# Altium project PA_CONTROL_BOARD.PrjPcb
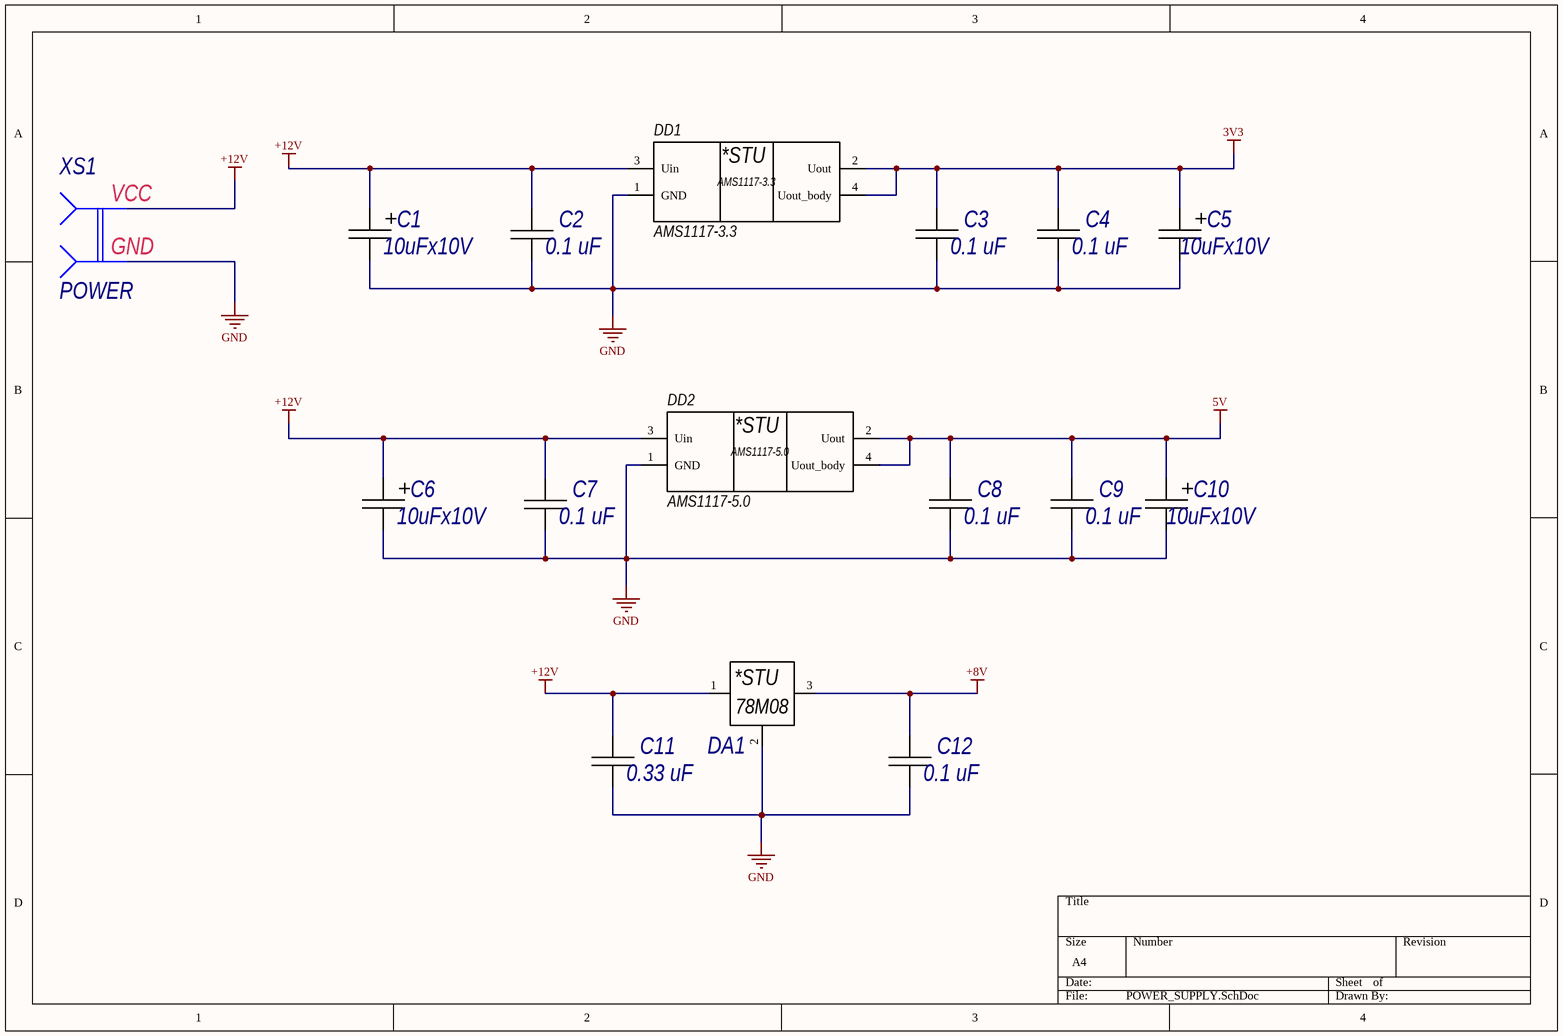
[diagram p0: POWER_SUPPLY.SchDoc]
12 sheets, 125 parts. Net scope: flat (ports and power ports of the same name join across sheets).
Board file: PA_CONTROL_BOARD.PcbDoc
Sheets:
  POWER_SUPPLY.SchDoc
  CAN.SchDoc
  FLASH.SchDoc
  DS18B20.SchDoc
  DIRECTIONAL_COUPLER.SchDoc
  FAN_CTRL.SchDoc
  JTAG_MCU.SchDoc
  MCU_CORE.SchDoc
  IIC_LCD.SchDoc
  EEPROM.SchDoc
  USB.SchDoc
  RS485.SchDoc

## Sheet POWER_SUPPLY.SchDoc
size A4; SheetNumber: 1; SheetTotal: 3

### Parts
C1  10uFx10V
C2  0.1 uF  [C0805C]
C3  0.1 uF  [C0805C]
C4  0.1 uF  [C0805C]
C5  10uFx10V  [TECAP_D]
C6  10uFx10V
C7  0.1 uF  [C0805C]
C8  0.1 uF  [C0805C]
C9  0.1 uF  [C0805C]
C10  10uFx10V  [TECAP_D]
C11  0.33 uF  [C0805C]
C12  0.1 uF  [C0805C]
DA1  78M08CDT  [SC_TO-252AA]  (value not drawn)
DD1  AMS1117-3.3  [SOT229P700X180-4N]
DD2  AMS1117-5.0  [SOT229P700X180-4N]
XS1  POWER  [DG25C-B-02P-13]

### Nets
3V3: C3.2 C4.2 C5.1 DD1.2(Uout) DD1.4(Uout_body)
5V: C8.2 C9.2 C10.1 DD2.2(Uout) DD2.4(Uout_body)
+8V: C12.2 DA1.3(Out)
+12V: C1.1 C2.2 C6.1 C7.2 C11.2 DA1.1(In) DD1.3(Uin) DD2.3(Uin) XS1.2
GND: C1.2 C2.1 C3.1 C4.1 C5.2 C6.2 C7.1 C8.1 C9.1 C10.2 C11.1 C12.1 DA1.2(GND) DD1.1(GND) DD2.1(GND) XS1.1

### Notes on the sheet
- (in symbol 78M08CDT) *STU; 78M08
- (in symbol AMS1117-3.3) *STU
- (in symbol AMS1117-5.0) *STU
- (in symbol CONNECT_PW) VCC; GND

### Library data of the parts
C1 C5 C6 C10 = CAP_TECAP_A: Type: Конденсатор; Published: 20.08.2010; Publisher: Andrew Danich
C2-C4 C7-C9 C11 C12 = CAP_0805: Type: Конденсатор; Published: 18.05.2010; Publisher: Andrew Danich
DD1 = AMS1117-3.3: Sot223/Pkg 1-Amp 3.3-Volt Low Drop Out Voltage Regulatator; MF: Advanced Monolithic Systems; Price: None; Package: None; Value: *; MP: AMS1117-3.3; Availability: Unavailable; SnapEDA_Link: https://www.snapeda.com/parts/AMS1117-3.3/Advanced%20Monolithic%20Systems/view-part/53450/?ref=snap
DD2 = AMS1117-5.0: Sot223/Pkg 1-Amp 3.3-Volt Low Drop Out Voltage Regulatator; MP: AMS1117-3.3; MF: Advanced Monolithic Systems; Price: None; Package: None; Value: *; Availability: Unavailable; SnapEDA_Link: https://www.snapeda.com/parts/AMS1117-3.3/Advanced%20Monolithic%20Systems/view-part/53450/?ref=snap
XS1 = CONNECT_PW: Value: Connector; Published: 07.03.2013; Publisher: Andrew Danich; Type: Розетка
DA1 = 78M08CDT: Published: 13.08.2015; Publisher: Andrew Danich; Type: Микросхема

## Sheet CAN.SchDoc
size A4
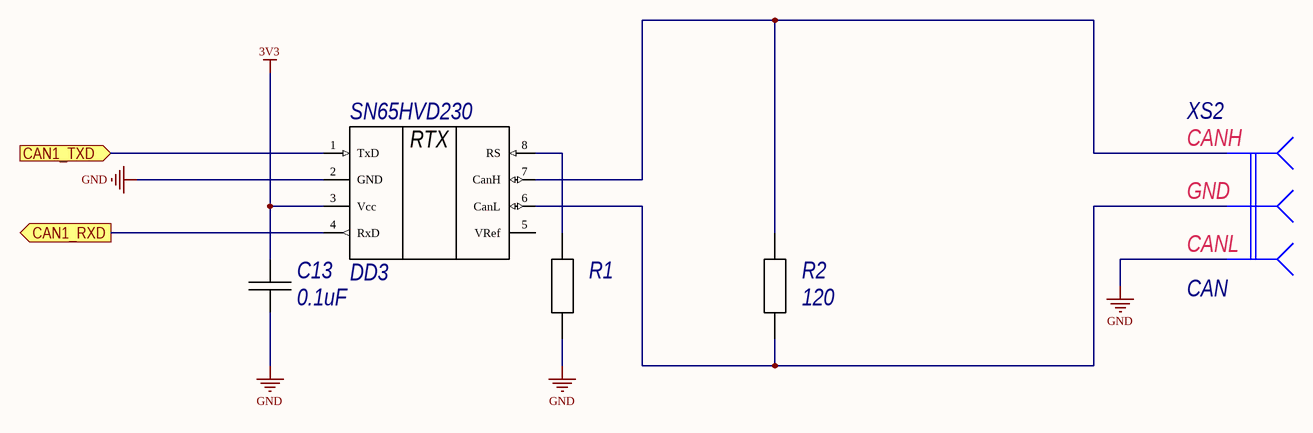
[diagram p1: CAN.SchDoc]

### Parts
C13  0.1uF  [C0805C]
DD3  SN65HVD230  [SOIC8 (SO-8)]
R1  R0805  [C0805R]  (value not drawn)
R2  120  [C0805R]
XS2  CAN  [YX-XH-3]

### Ports
CAN1_RXD (out), CAN1_TXD (in)

### Nets
3V3: C13.2 DD3.3(Vcc)
GND: C13.1 DD3.2(GND) R1.2 XS2.3
CAN1_RXD: DD3.4(RxD) ; port CAN1_RXD
CAN1_TXD: DD3.1(TxD) ; port CAN1_TXD
NetDD3_6: DD3.6(CanL) R2.2 XS2.2
NetDD3_7: DD3.7(CanH) R2.1 XS2.1
NetDD3_8: DD3.8(RS) R1.1

Not connected (* = marked no-connect by the designer): DD3 5(VRef)

### Notes on the sheet
- (in symbol CONNECT_CAN) CANH; GND; CANL
- (in symbol SN65HVD230) RTX

### Library data of the parts
C13 = CAP_0805: Type: Конденсатор; Published: 18.05.2010; Publisher: Andrew Danich
DD3 = SN65HVD230: Высокоскоростной CAN-Трансивер, 1Мб/с, 12В/24В, до 112 узлов; Published: 26.02.2013; Publisher: Andrew Danich; Type: Микросхема
R2 = R0805: Published: 24.03.2010; Publisher: Andrew Danich; Type: Резистор
XS2 = CONNECT_CAN: Published: 07.03.2013; Publisher: Andrew Danich; Type: Розетка
R1 = R0805: Published: 24.03.2010; Publisher: Andrew Danich; Type: Резистор

## Sheet FLASH.SchDoc
size A4
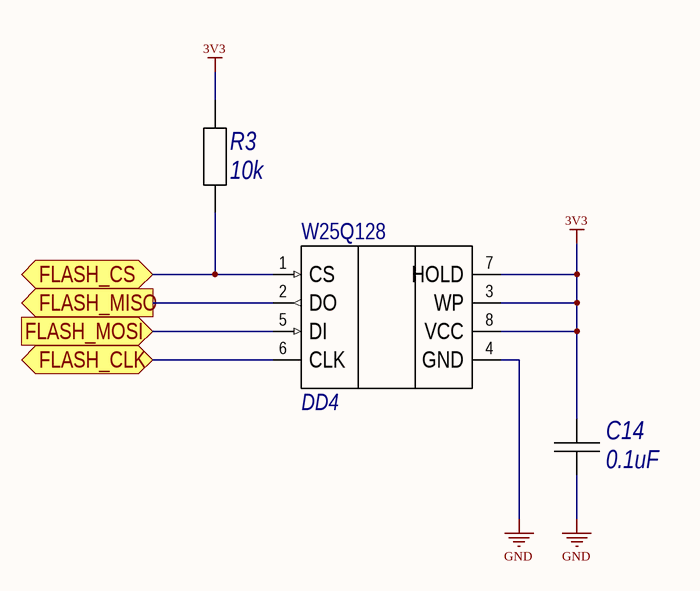
[diagram p2: FLASH.SchDoc]

### Parts
C14  0.1uF  [C0805C]
DD4  W25Q128  [SOIC8 (SO-8)]
R3  10k  [C0805R]

### Ports
FLASH_CLK (bidir), FLASH_CS (bidir), FLASH_MISO (out), FLASH_MOSI (in)

### Nets
3V3: C14.2 DD4.3(WP) DD4.7(HOLD) DD4.8(VCC) R3.2
GND: C14.1 DD4.4(GND)
FLASH_CLK: DD4.6(CLK) ; port FLASH_CLK
FLASH_CS: DD4.1(CS) R3.1 ; port FLASH_CS
FLASH_MISO: DD4.2(DO) ; port FLASH_MISO
FLASH_MOSI: DD4.5(DI) ; port FLASH_MOSI

### Library data of the parts
C14 = CAP_0805: Type: Конденсатор; Published: 18.05.2010; Publisher: Andrew Danich
R3 = RES_0805: Published: 24.03.2010; Publisher: Andrew Danich; Type: Резистор
DD4 = W25Q128: Value: *

## Sheet DS18B20.SchDoc
size A4
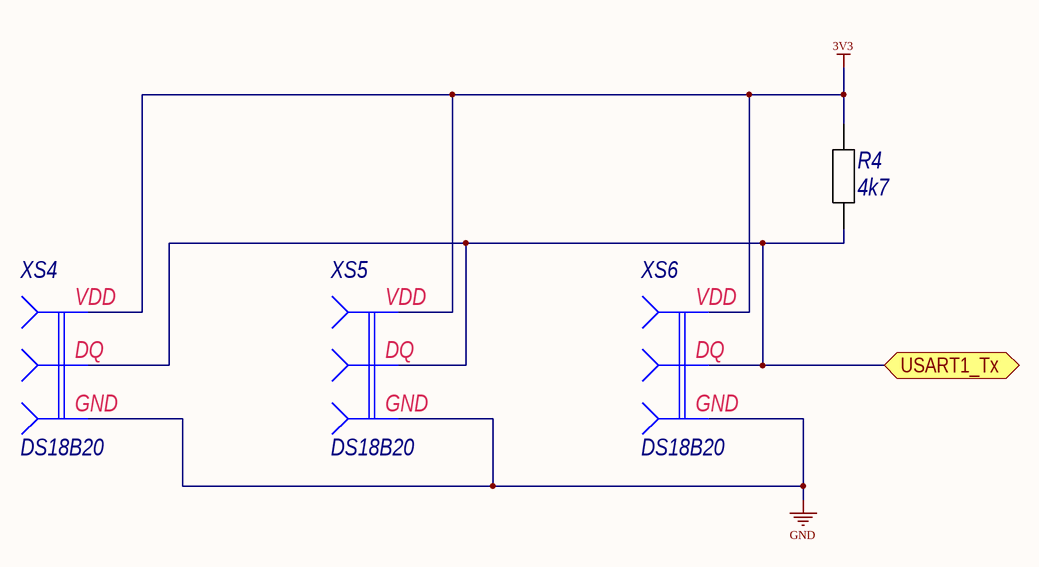
[diagram p3: DS18B20.SchDoc]

### Parts
R4  4k7  [C0805R]
XS4  DS18B20  [YX-XH-3]
XS5  DS18B20  [YX-XH-3]
XS6  DS18B20  [YX-XH-3]

### Ports
USART1_Tx (bidir)

### Nets
3V3: R4.1 XS4.1 XS5.1 XS6.1
GND: XS4.3 XS5.3 XS6.3
DS18B20: R4.2 XS4.2 XS5.2 XS6.2 ; port USART1_Tx

### Notes on the sheet
- (in symbol DS18B20) VDD; DQ; GND

### Library data of the parts
R4 = R0805: Published: 24.03.2010; Publisher: Andrew Danich; Type: Резистор
XS4-XS6 = DS18B20: Published: 07.03.2013; Publisher: Andrew Danich; Type: Розетка

## Sheet DIRECTIONAL_COUPLER.SchDoc
size A4
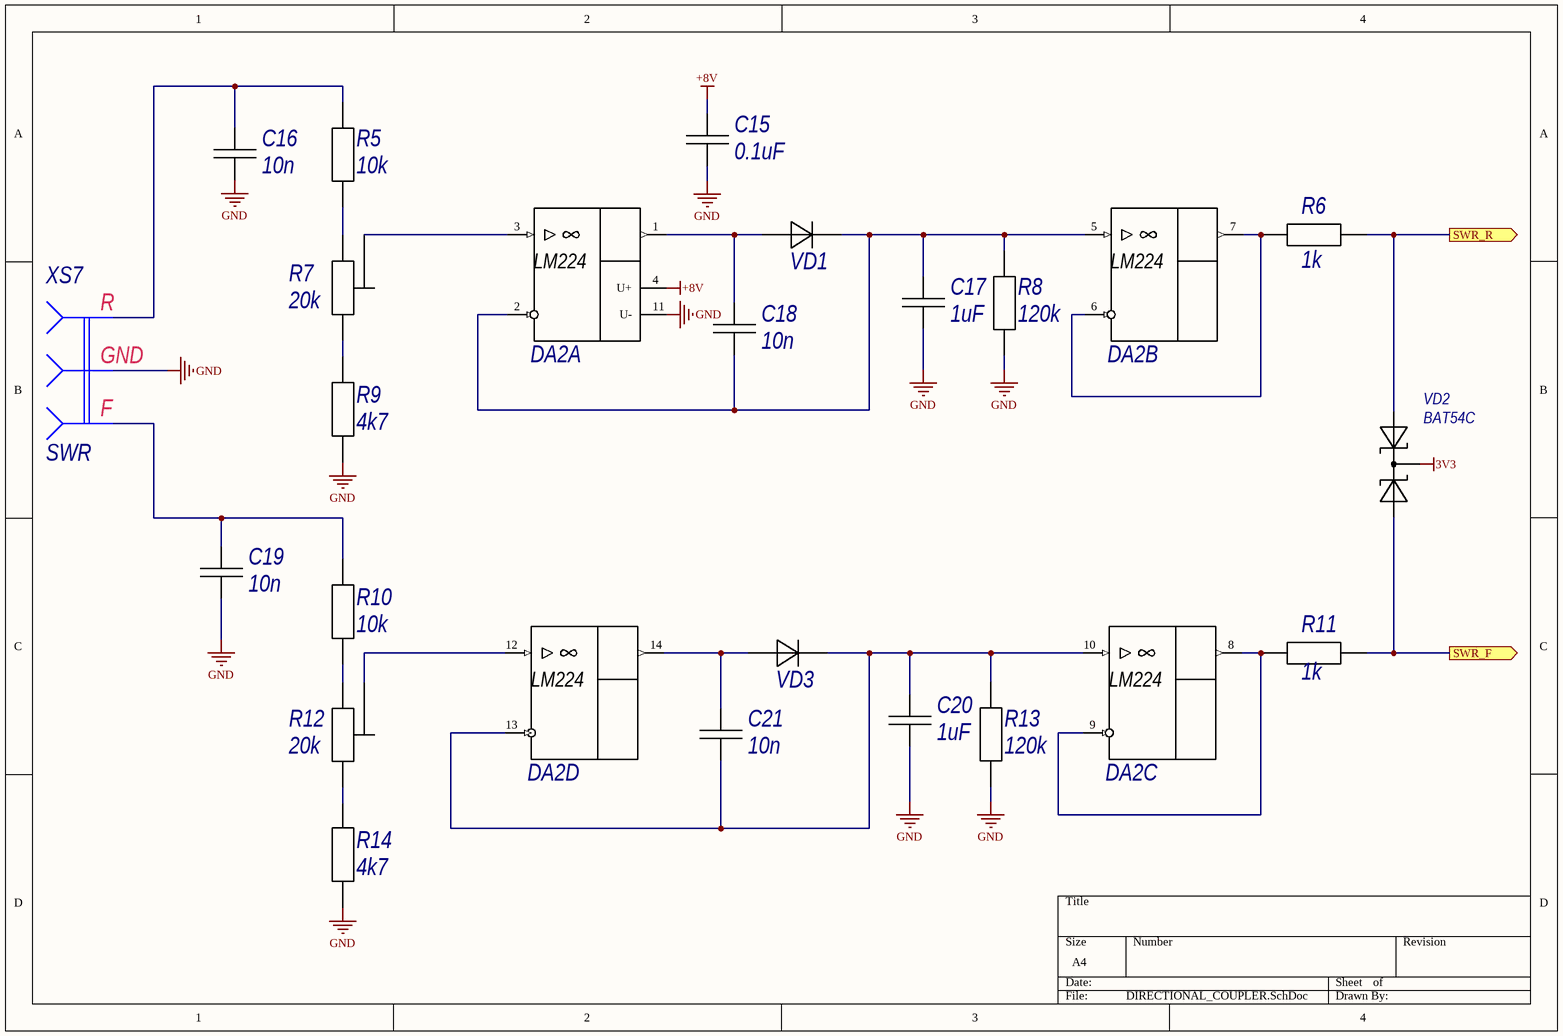
[diagram p4: DIRECTIONAL_COUPLER.SchDoc]

### Parts
C15  0.1uF  [C0805C]
C16  10n  [C0805C]
C17  1uF  [C0805C]
C18  10n  [C0805C]
C19  10n  [C0805C]
C20  1uF  [C0805C]
C21  10n  [C0805C]
DA2  LM224  [Texas_Instruments_D0014A_IPC_A]  (value not drawn)  (parts A,B,C,D of 4)
R5  10k  [C0805R]
R6  1k  [C0805R]
R7  20k  [TRIM_3296W-1-254LF]
R8  120k  [C0805R]
R9  4k7  [C0805R]
R10  10k  [C0805R]
R11  1k  [C0805R]
R12  20k  [TRIM_3296W-1-254LF]
R13  120k  [C0805R]
R14  4k7  [C0805R]
VD1  LL4148  [DIO_LL4148]  (value not drawn)
VD2  BAT54C  [BAT54C_SOT23-3]
VD3  LL4148  [DIO_LL4148]  (value not drawn)
XS7  SWR  [YX-XH-3]

### Ports
SWR_F (out), SWR_R (out)

### Nets
3V3: VD2.3(AC)
+8V: C15.2 DA2.4(U+)
GND: C15.1 C16.1 C17.1 C19.1 C20.1 DA2.11(U-) R8.2 R9.1 R13.1 R14.1 XS7.2
SWR_F: R11.1 VD2.2(C) ; port SWR_F
SWR_R: R6.1 VD2.1(А1) ; port SWR_R
NetC16_2: C16.2 R5.2 XS7.1
NetC17_2: C17.2 C18.1 DA2.2(IN-) DA2.5(IN+) R8.1 VD1.2(К)
NetC18_2: C18.2 DA2.1(OUT) VD1.1(А)
NetC19_2: C19.2 R10.2 XS7.3
NetC20_2: C20.2 C21.1 DA2.10(IN+) DA2.13(IN-) R13.2 VD3.2(К)
NetC21_2: C21.2 DA2.14(OUT) VD3.1(А)
NetDA2_3: DA2.3(IN+) R7.2
NetDA2_6: DA2.6(IN-) DA2.7(OUT) R6.2
NetDA2_8: DA2.8(OUT) DA2.9(IN-) R11.2
NetDA2_12: DA2.12(IN+) R12.2
NetR5_1: R5.1 R7.1
NetR7_3: R7.3 R9.2
NetR10_1: R10.1 R12.1
NetR12_3: R12.3 R14.2

### Notes on the sheet
- (in symbol DIR_COUP) R; GND; F

### Library data of the parts
C15-C21 = CAP_0805: Type: Конденсатор; Published: 18.05.2010; Publisher: Andrew Danich
R5 R6 R8-R11 R13 R14 = RES_0805: Published: 24.03.2010; Publisher: Andrew Danich; Type: Резистор
R7 R12 = Resistor-Trimmer-1: Publisher: Andrew Danich; Type: Подстроечный резистор; Published: 27.07.2015
VD1 VD3 = LL4148: Type: Диод; Published: 18.05.2010; Publisher: Andrew Danich
VD2 = BAT54C: Small Signal Schottky Diode, Dual Common Cathode, 30 V, 200 mA, 400 mV, 600 mA, 125 C
XS7 = DIR_COUP: Published: 07.03.2013; Publisher: Andrew Danich; Type: Розетка
DA2 = LM224: Published: 29.07.2015; Publisher: Andrew Danich; Type: Микросхема

## Sheet FAN_CTRL.SchDoc
size A4
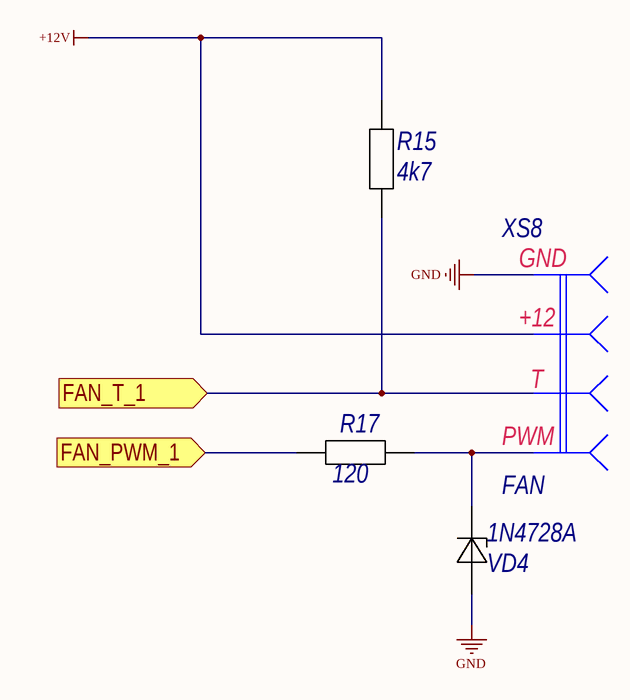
[diagram p5: FAN_CTRL.SchDoc]

### Parts
R15  4k7  [C0805R]
R17  120  [C0805R]
VD4  1N4728A  [DO-41]
XS8  FAN  [WF-4]

### Ports
FAN_PWM_1 (in), FAN_T_1 (in)

### Nets
+12V: R15.2 XS8.2
GND: VD4.1(А) XS8.1
PWM_1: R17.1 ; port FAN_PWM_1
T_1: R15.1 XS8.3 ; port FAN_T_1
NetR17_2: R17.2 VD4.2(К) XS8.4

### Notes on the sheet
- (in symbol FAN_CON) GND; +12; T; PWM

### Library data of the parts
R15 R17 = RES_0805: Published: 24.03.2010; Publisher: Andrew Danich; Type: Резистор
VD4 = 1N4728A: Type: Стабилитрон; Published: 20.05.2013; Publisher: Andrew Danich
XS8 = FAN_CON: Value: Connector; Published: 07.03.2013; Publisher: Andrew Danich; Type: Розетка

## Sheet JTAG_MCU.SchDoc
size A3
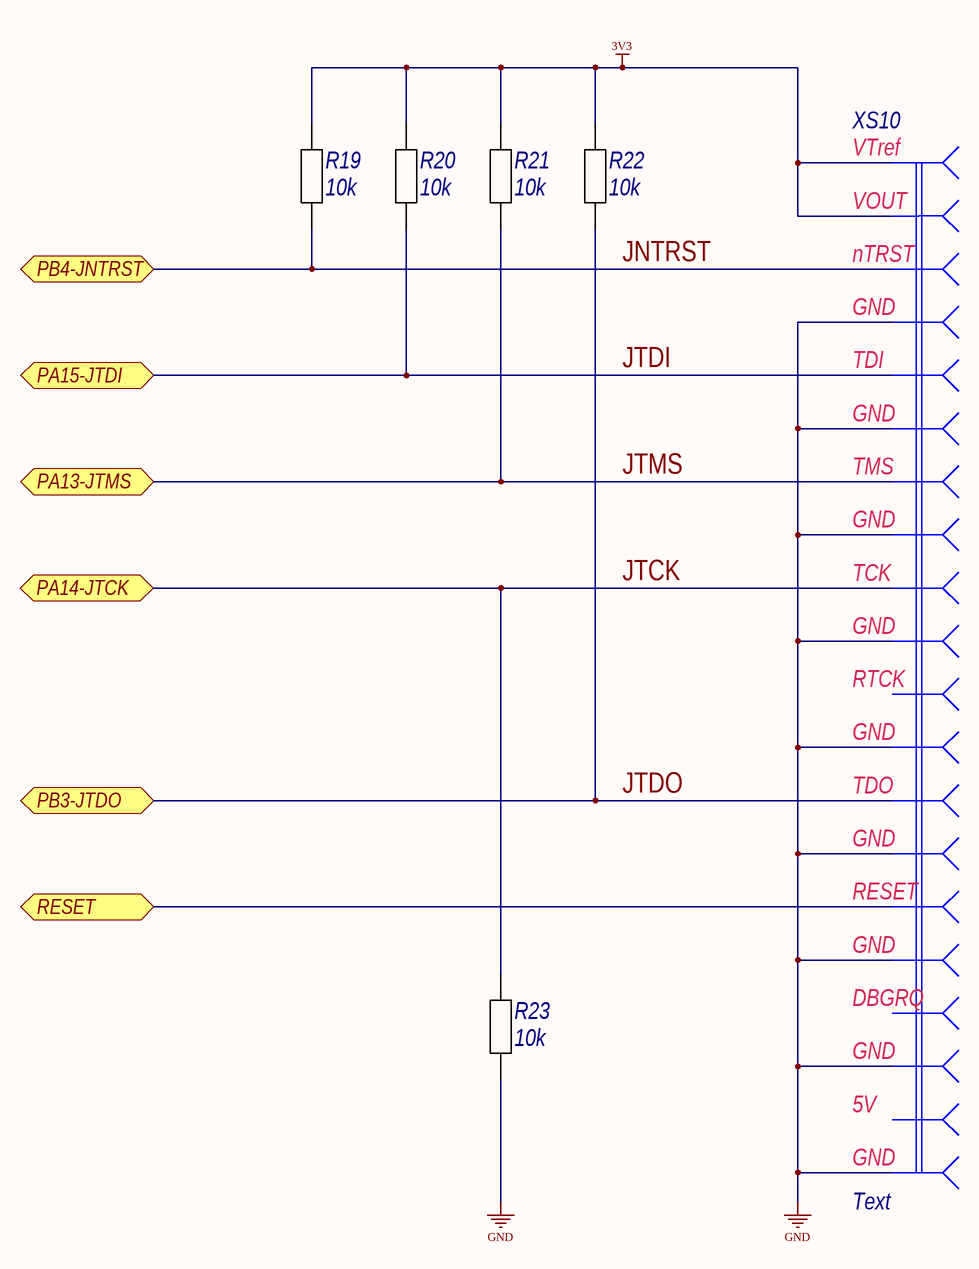
[diagram p6: JTAG_MCU.SchDoc]

### Parts
R19  10k  [C0805R]
R20  10k  [C0805R]
R21  10k  [C0805R]
R22  10k  [C0805R]
R23  10k  [C0805R]
XS10  Text  [IDC-20]

### Ports
PA13-JTMS (bidir), PA14-JTCK (bidir), PA15-JTDI (bidir), PB3-JTDO (bidir), PB4-JNTRST (bidir), RESET (bidir)

### Nets
3V3: R19.2 R20.2 R21.2 R22.2 XS10.1 XS10.2
GND: R23.1 XS10.4 XS10.6 XS10.8 XS10.10 XS10.12 XS10.14 XS10.16 XS10.18 XS10.20
JNTRST: R19.1 XS10.3 ; port PB4-JNTRST
JTCK: R23.2 XS10.9 ; port PA14-JTCK
JTDI: R20.1 XS10.5 ; port PA15-JTDI
JTDO: R22.1 XS10.13 ; port PB3-JTDO
JTMS: R21.1 XS10.7 ; port PA13-JTMS
NRST: XS10.15 ; port RESET

Not connected (* = marked no-connect by the designer): XS10 11 17 19

### Notes on the sheet
- (in symbol JTAG) VTref; VOUT; nTRST; GND; TDI; TMS; TCK; RTCK; TDO; RESET; DBGRQ; 5V

### Library data of the parts
R19-R23 = R0805: Published: 24.03.2010; Publisher: Andrew Danich; Type: Резистор
XS10 = JTAG: Value: Connector; Published: 07.03.2013; Publisher: Andrew Danich; Type: Розетка

## Sheet MCU_CORE.SchDoc
size A2
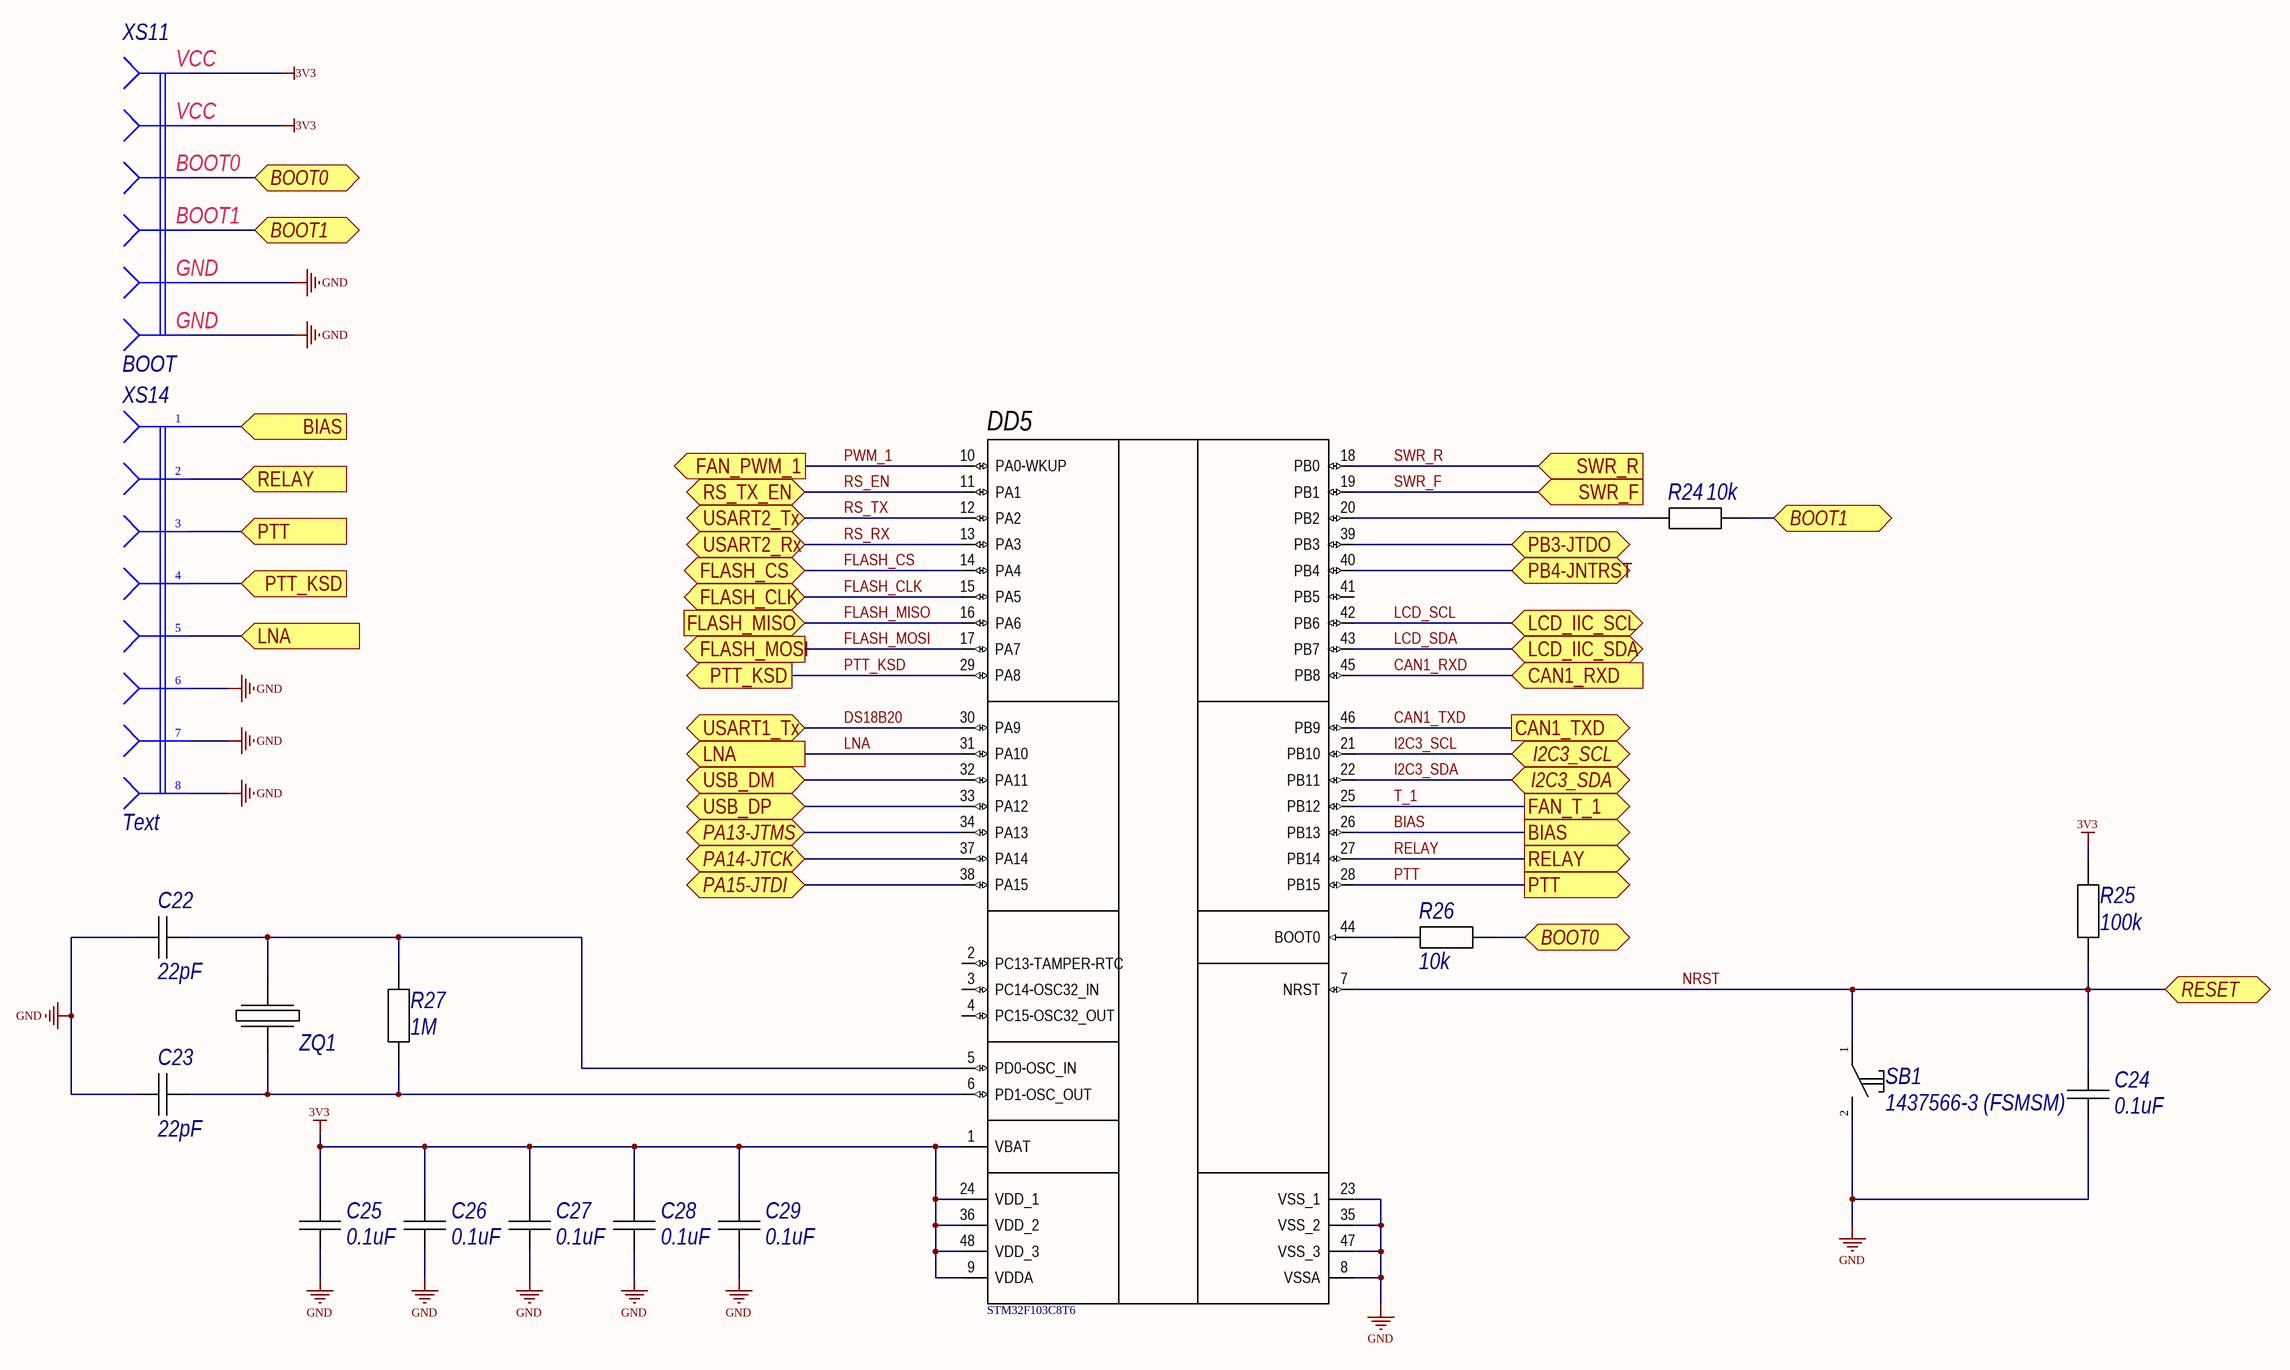
[diagram p7: MCU_CORE.SchDoc]

### Parts
C22  22pF  [C0805C]
C23  22pF  [C0805C]
C24  0.1uF  [C0805C]
C25  0.1uF  [C0805C]
C26  0.1uF  [C0805C]
C27  0.1uF  [C0805C]
C28  0.1uF  [C0805C]
C29  0.1uF  [C0805C]
DD5  STM32F103C8T6  [STM-LQFP48_L]
R24  10k  [C0805R]
R25  100k  [C0805R]
R26  10k  [C0805R]
R27  1M  [C0805R]
SB1  1437566-3 (FSMSM)  [1437566-3]
XS11  BOOT  [PLD2-3]
XS14  Text  [WF-8]
ZQ1  HC49SM  [HC49SM]  (value not drawn)

### Ports
BIAS (in), BIAS (out), BOOT0 (bidir), BOOT1 (bidir), CAN1_RXD (in), CAN1_TXD (out), FAN_PWM_1 (out), FAN_T_1 (out), FLASH_CLK (bidir), FLASH_CS (bidir), FLASH_MISO (in), FLASH_MOSI (out), I2C3_SCL (bidir), I2C3_SDA (bidir), LCD_IIC_SCL (bidir), LCD_IIC_SDA (bidir), LNA (in), LNA (out), PA13-JTMS (bidir), PA14-JTCK (bidir), PA15-JTDI (bidir), PB3-JTDO (bidir), PB4-JNTRST (bidir), PTT (in), PTT (out), PTT_KSD (in), PTT_KSD (out), RELAY (in), RELAY (out), RESET (bidir), RS_TX_EN (bidir), SWR_F (in), SWR_R (in), USART1_Tx (bidir), USART2_Rx (bidir), USART2_Tx (bidir), USB_DM (bidir), USB_DP (bidir)

### Nets
3V3: C25.2 C26.2 C27.2 C28.2 C29.2 DD5.1(VBAT) DD5.9(VDDA) DD5.24(VDD_1) DD5.36(VDD_2) DD5.48(VDD_3) R25.1 XS11.1 XS11.2
GND: C22.1 C23.1 C24.1 C25.1 C26.1 C27.1 C28.1 C29.1 DD5.8(VSSA) DD5.23(VSS_1) DD5.35(VSS_2) DD5.47(VSS_3) SB1.2 XS11.5 XS11.6 XS14.6 XS14.7 XS14.8
BIAS: DD5.26(PB13) XS14.1 ; port BIAS
CAN1_RXD: DD5.45(PB8) ; port CAN1_RXD
CAN1_TXD: DD5.46(PB9) ; port CAN1_TXD
DS18B20: DD5.30(PA9) ; port USART1_Tx
FLASH_CLK: DD5.15(PA5) ; port FLASH_CLK
FLASH_CS: DD5.14(PA4) ; port FLASH_CS
FLASH_MISO: DD5.16(PA6) ; port FLASH_MISO
FLASH_MOSI: DD5.17(PA7) ; port FLASH_MOSI
I2C3_SCL: DD5.21(PB10) ; port I2C3_SCL
I2C3_SDA: DD5.22(PB11) ; port I2C3_SDA
JNTRST: DD5.40(PB4) ; port PB4-JNTRST
JTCK: DD5.37(PA14) ; port PA14-JTCK
JTDI: DD5.38(PA15) ; port PA15-JTDI
JTDO: DD5.39(PB3) ; port PB3-JTDO
JTMS: DD5.34(PA13) ; port PA13-JTMS
LCD_SCL: DD5.42(PB6) ; port LCD_IIC_SCL
LCD_SDA: DD5.43(PB7) ; port LCD_IIC_SDA
LNA: DD5.31(PA10) XS14.5 ; port LNA
NRST: C24.2 DD5.7(NRST) R25.2 SB1.1 ; port RESET
PTT: DD5.28(PB15) XS14.3 ; port PTT
PTT_KSD: DD5.29(PA8) XS14.4 ; port PTT_KSD
PWM_1: DD5.10(PA0-WKUP) ; port FAN_PWM_1
RELAY: DD5.27(PB14) XS14.2 ; port RELAY
RS_EN: DD5.11(PA1) ; port RS_TX_EN
RS_RX: DD5.13(PA3) ; port USART2_Rx
RS_TX: DD5.12(PA2) ; port USART2_Tx
SWR_F: DD5.19(PB1) ; port SWR_F
SWR_R: DD5.18(PB0) ; port SWR_R
T_1: DD5.25(PB12) ; port FAN_T_1
NetC22_2: C22.2 DD5.5(PD0-OSC_IN) R27.2 ZQ1.1
NetC23_2: C23.2 DD5.6(PD1-OSC_OUT) R27.1 ZQ1.2
NetDD5_20: DD5.20(PB2) R24.2
NetDD5_32: DD5.32(PA11) ; port USB_DM
NetDD5_33: DD5.33(PA12) ; port USB_DP
NetDD5_44: DD5.44(BOOT0) R26.2
NetR24_1: R24.1 XS11.4 ; port BOOT1
NetR26_1: R26.1 XS11.3 ; port BOOT0

Not connected (* = marked no-connect by the designer): DD5 2(PC13-TAMPER-RTC) 3(PC14-OSC32_IN) 4(PC15-OSC32_OUT) 41(PB5)

### Notes on the sheet
- (in symbol CONNECT_BOOT) VCC; BOOT0; BOOT1; GND

### Library data of the parts
C22-C29 = CAP_0805: Type: Конденсатор; Published: 18.05.2010; Publisher: Andrew Danich
DD5 = STM32F103C8T6: ARM Cortex-M3 32-bit MCU, 64 KB Flash, 20 KB Internal RAM, 37 I/Os, 48-pin LQFP, -40 to 85 degC, Tray; A/D Converter: 2x12-bit (10 Channel); FLASH Size (Prog) (kB): 64; I/Os (High Current): 37; Internal RAM Size (kB): 20; Operating Frequency(F) (Processor speed) (MHz): 72; Supply Voltage(Vcc) min (V): 2; DatasheetVersion: Rev. 16; PackageVersion: Rev. 6, 06/2013; PackageReference: LQFP48; PackageDescription: 48-Pin Low Profile Quad Flat Package, 7 x 7 mm Body, 0.5 mm Pitch; Supplier 1: Digi-Key; Supplier Part Number 1: 497-6063-ND; Supplier 2: Farnell; Supplier Part Number 2: 1447637; Supplier 3: Newark; Supplier Part Number 3: 59M2182; Supplier 4: Newark; Supplier Part Number 4: 57P1222; Supplier 5: Mouser; Supplier Part Number 5: 511-STM32F103C8T6; Core: ARM Cortex-M3; Packing: Tray; Mounting Technology: Surface Mount; PartNumber: STM32F103C8T6; ComponentLink1Description: Manufacturer URL; ComponentLink1URL: http://www.st.com/web/en/home.html; ComponentLink2Description: Datasheet; ComponentLink2URL: http://www.st.com/st-web-ui/static/active/en/resource/technical/document/datasheet/CD00161566.pdf; ComponentLink3Description: Package Specification; ComponentLink3URL: http://www.st.com/st-web-ui/static/active/en/resource/technical/document/datasheet/DM00058181.pdf
R24-R27 = RES_0805: Published: 24.03.2010; Publisher: Andrew Danich; Type: Резистор
SB1 = BT-01x-01p: Published: 17.04.2014; Publisher: Andrew Danich; Type: Переключатель
XS11 = CONNECT_BOOT: Value: Connector; Published: 07.03.2013; Publisher: Andrew Danich; Type: Розетка
XS14 = Con-8-F: Value: Connector; Published: 07.03.2013; Publisher: Andrew Danich; Type: Розетка
ZQ1 = HC49SM: Published: 08.03.2013; Publisher: Andrew Danich; Type: Резонатор

## Sheet IIC_LCD.SchDoc
size A3
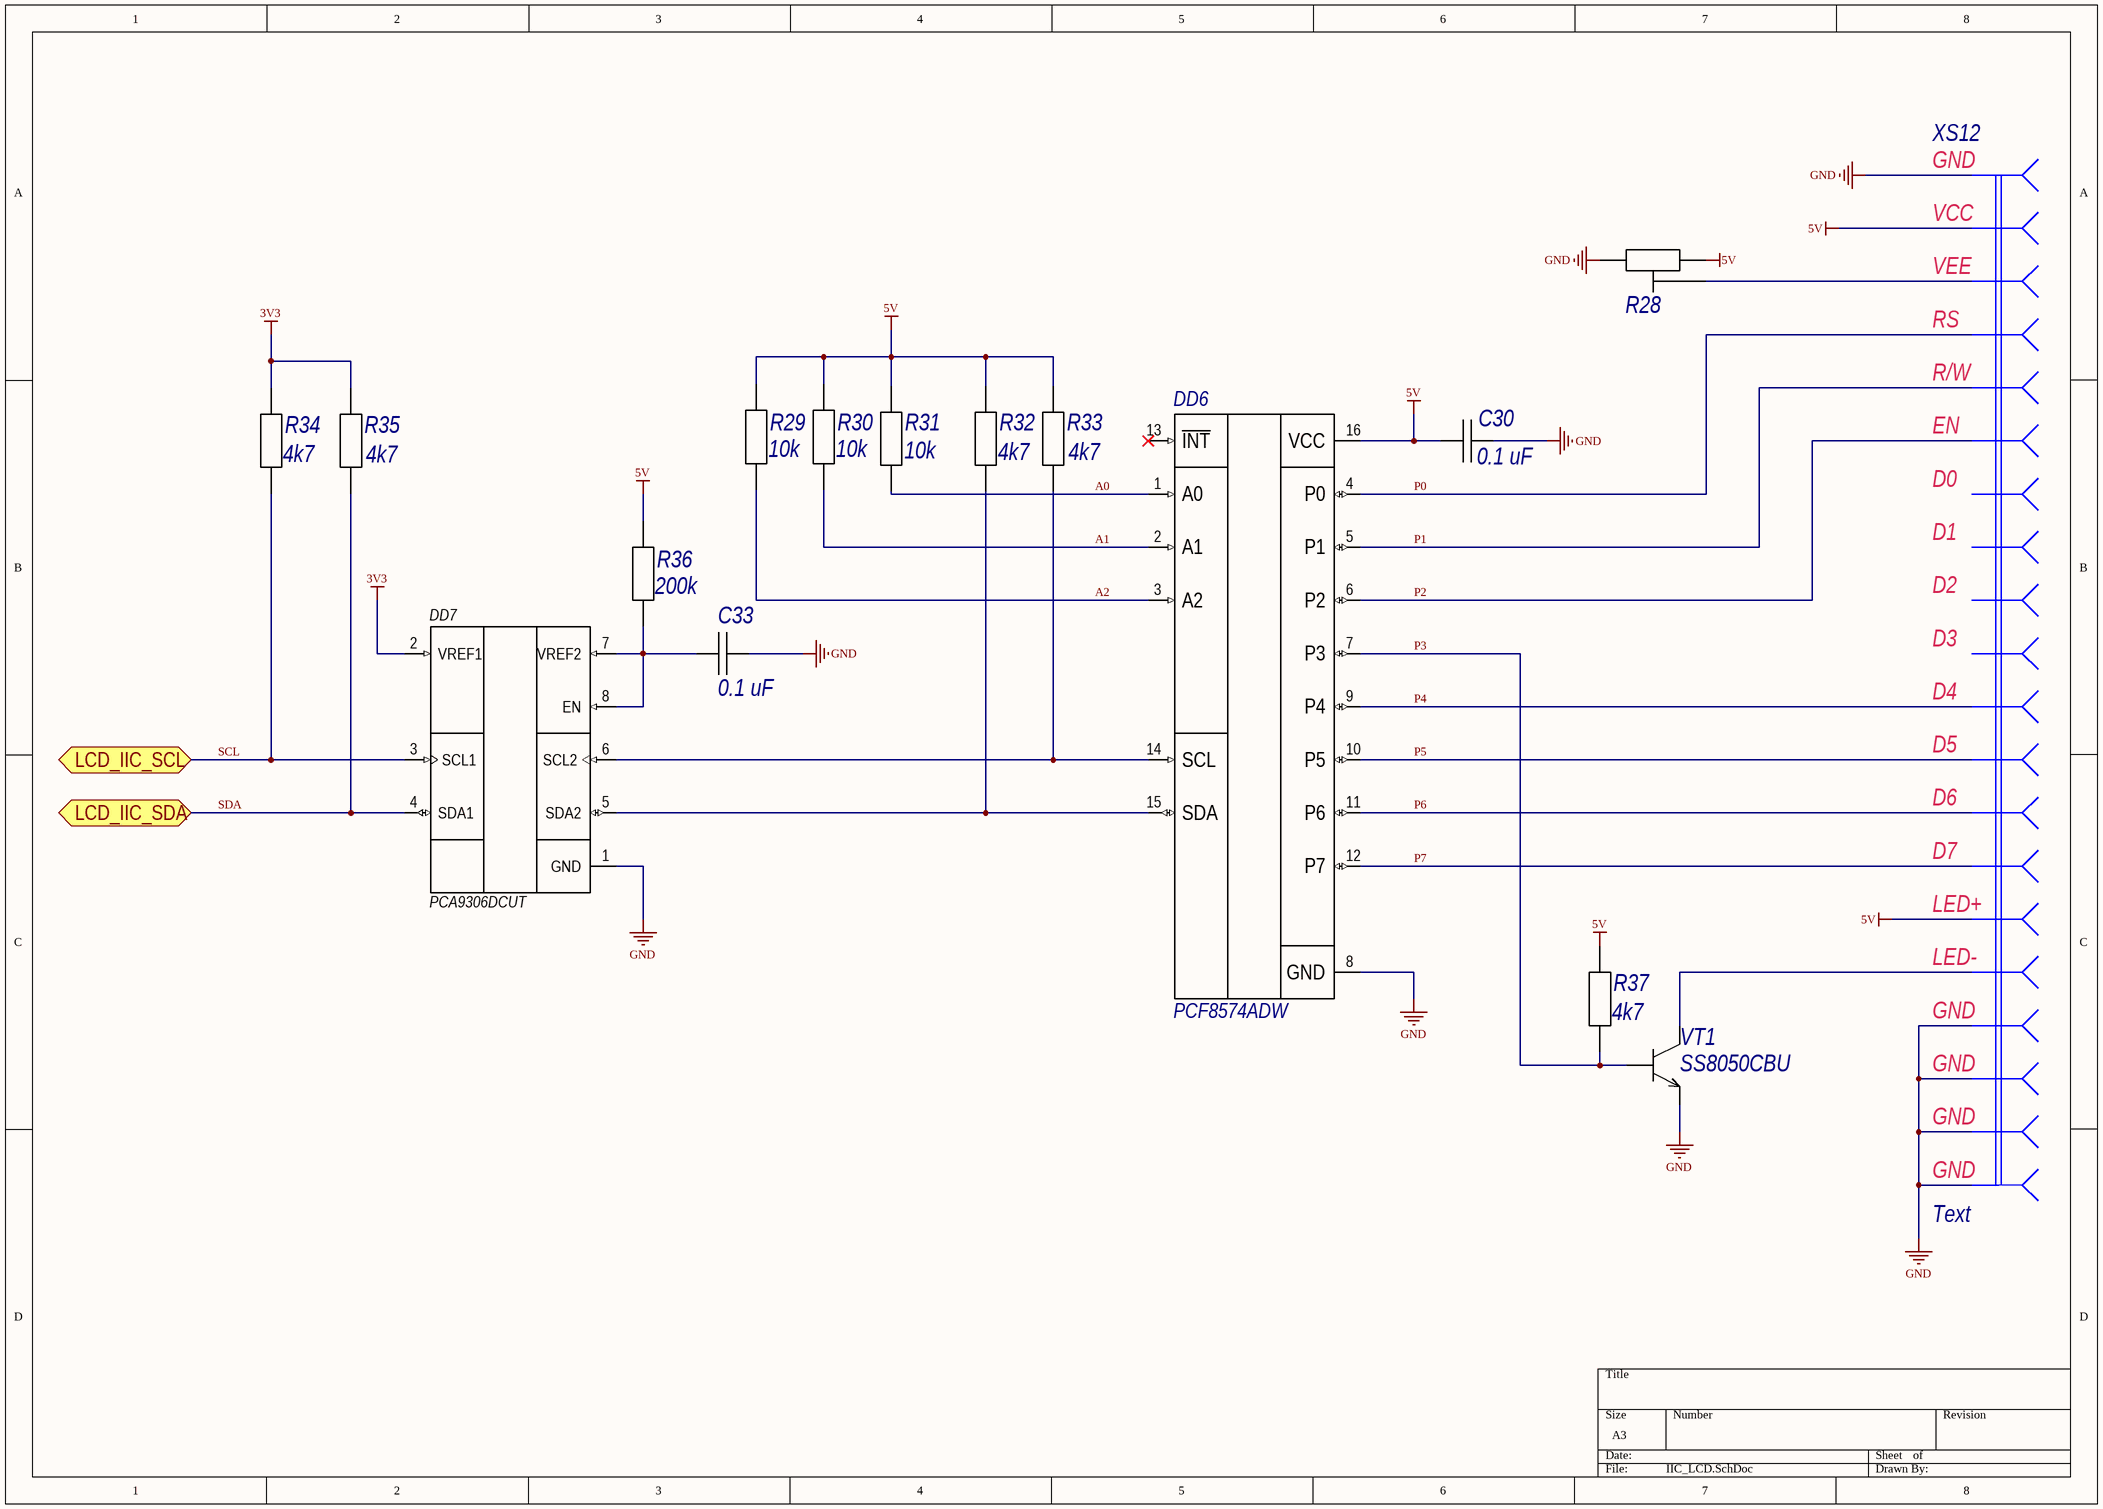
[diagram p8: IIC_LCD.SchDoc]

### Parts
C30  0.1 uF  [C0805C]
C33  0.1 uF  [C0805C]
DD6  PCF8574ADW  [SOIC127P1030X265-16N]
DD7  PCA9306DCUT  [SOP50P310X90-8N]
R28  RES_VAR  [TRIM_3296W-1-254LF]  (value not drawn)
R29  10k  [C0805R]
R30  10k  [C0805R]
R31  10k  [C0805R]
R32  4k7  [C0805R]
R33  4k7  [C0805R]
R34  4k7  [C0805R]
R35  4k7  [C0805R]
R36  200k  [C0805R]
R37  4k7  [C0805R]
VT1  SS8050CBU  [TO-92-A]
XS12  Text  [IDC-20]

### Ports
LCD_IIC_SCL (bidir), LCD_IIC_SDA (bidir)

### Nets
3V3: DD7.2(VREF1) R34.2 R35.2
5V: C30.2 DD6.16(VCC) R28.1 R29.2 R30.2 R31.2 R32.2 R33.2 R36.2 R37.2 XS12.2 XS12.15
GND: C30.1 C33.2 DD6.8(GND) DD7.1(GND) R28.3 VT1.3(Э) XS12.1 XS12.17 XS12.18 XS12.19 XS12.20
A0: DD6.1(A0) R31.1
A1: DD6.2(A1) R30.1
A2: DD6.3(A2) R29.1
P0: DD6.4(P0) XS12.4
P1: DD6.5(P1) XS12.5
P2: DD6.6(P2) XS12.6
P3: DD6.7(P3) R37.1 VT1.1(Б)
P4: DD6.9(P4) XS12.11
P5: DD6.10(P5) XS12.12
P6: DD6.11(P6) XS12.13
P7: DD6.12(P7) XS12.14
SCL: DD7.3(SCL1) R34.1 ; port LCD_IIC_SCL  [project net LCD_SCL]
SDA: DD7.4(SDA1) R35.1 ; port LCD_IIC_SDA  [project net LCD_SDA]
NetC33_1: C33.1 DD7.7(VREF2) DD7.8(EN) R36.1
NetDD6_14: DD6.14(SCL) DD7.6(SCL2) R33.1
NetDD6_15: DD6.15(SDA) DD7.5(SDA2) R32.1
NetR28_2: R28.2 XS12.3
NetVT1_2: VT1.2(К) XS12.16

Not connected (* = marked no-connect by the designer): DD6 13(~{INT})*; XS12 7 8 9 10

### Notes on the sheet
- (in symbol CONNECT_LCD) GND; VCC; VEE; RS; R/W; EN; D0; D1; D2; D3; D4; D5; D6; D7; LED+; LED-

### Library data of the parts
C30 C33 = CAP_0805: Type: Конденсатор; Published: 18.05.2010; Publisher: Andrew Danich
DD6 = PCF8574ADW: Remote 8-Bit I/O Expander for I2C-Bus 16-SOIC -40 to 85; MF: Texas Instruments; Mouser-Purchase-URL: https://snapeda.com/shop?store=Mouser&id=554599; SnapEDA_Link: https://www.snapeda.com/parts/PCF8574ADW/Texas%20Instruments/view-part/554599/?ref=snap; DigiKey-Purchase-URL: https://snapeda.com/shop?store=DigiKey&id=554599; Package: SOIC-16 Texas Instruments; MP: PCF8574ADW; Price: None; Availability: Warning; Texas_Instruments-Purchase-URL: https://snapeda.com/shop?store=Texas+Instruments&id=554599; Value: *
DD7 = PCA9306DCUT: 2-bit bidirectional I2C bus and SMBus voltage-level shifter 8-VSSOP -40 to 85; MF: Texas Instruments; SnapEDA_Link: https://www.snapeda.com/parts/PCA9306DCUT/Texas%20Instruments/view-part/39070/?ref=snap; DigiKey-Purchase-URL: https://snapeda.com/shop?store=DigiKey&id=39070; MP: PCA9306DCUT; Arrow_Electronics-Purchase-URL: https://snapeda.com/shop?store=Arrow+Electronics&id=39070; Availability: Good; Package: VSSOP-8 Texas Instruments; Mouser-Purchase-URL: https://snapeda.com/shop?store=Mouser&id=39070; Price: None; Value: *; Texas_Instruments-Purchase-URL: https://snapeda.com/shop?store=Texas+Instruments&id=39070
R29-R37 = RES_0805: Published: 24.03.2010; Publisher: Andrew Danich; Type: Резистор
VT1 = SS8050CBU: Type: Транзистор; Published: 07.05.2013; Publisher: Andrew Danich
XS12 = CONNECT_LCD: Value: Connector; Published: 07.03.2013; Publisher: Andrew Danich; Type: Розетка
R28 = RES_VAR: Publisher: Andrew Danich; Type: Подстроечный резистор; Published: 27.07.2015

## Sheet EEPROM.SchDoc
size A3
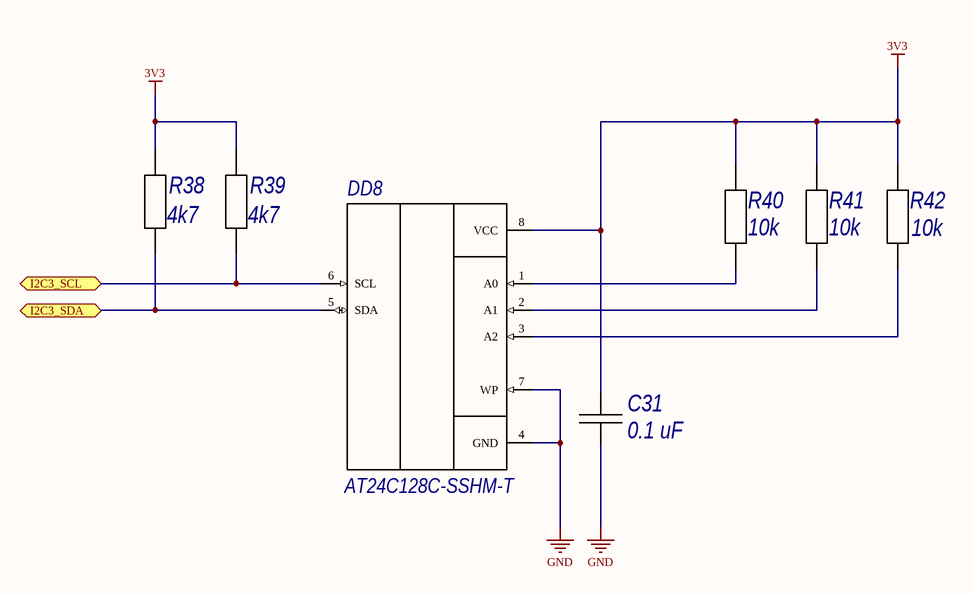
[diagram p9: EEPROM.SchDoc]

### Parts
C31  0.1 uF  [C0805C]
DD8  AT24C128C-SSHM-T  [SOIC127P600X175-8N]
R38  4k7  [C0805R]
R39  4k7  [C0805R]
R40  10k  [C0805R]
R41  10k  [C0805R]
R42  10k  [C0805R]

### Ports
I2C3_SCL (bidir), I2C3_SDA (bidir)

### Nets
3V3: C31.2 DD8.8(VCC) R38.2 R39.2 R40.2 R41.2 R42.2
GND: C31.1 DD8.4(GND) DD8.7(WP)
I2C3_SCL: DD8.6(SCL) R39.1 ; port I2C3_SCL
I2C3_SDA: DD8.5(SDA) R38.1 ; port I2C3_SDA
NetDD8_1: DD8.1(A0) R40.1
NetDD8_2: DD8.2(A1) R41.1
NetDD8_3: DD8.3(A2) R42.1

### Library data of the parts
C31 = CAP_0805: Type: Конденсатор; Published: 18.05.2010; Publisher: Andrew Danich
DD8 = AT24C128C-SSHM-T: EEPROM Memory IC 128Kb _16K x 8_ IÂ²C 1MHz 550ns 8-SOIC; MF: Microchip; MP: AT24C128C-SSHM-T; SnapEDA_Link: https://www.snapeda.com/parts/AT24C128C-SSHM-T/Microchip/view-part/1771999/?ref=snap; Value: *; Package: SO-8 Microchip; Price: None; Availability: Unavailable
R38-R42 = RES_0805: Published: 24.03.2010; Publisher: Andrew Danich; Type: Резистор

## Sheet USB.SchDoc
size A4
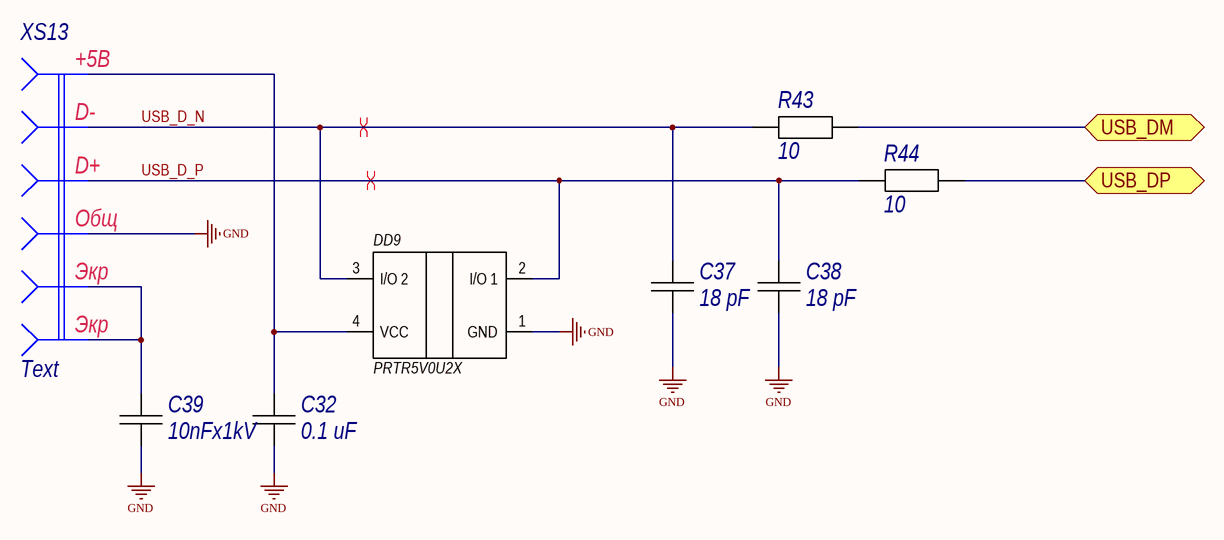
[diagram p10: USB.SchDoc]

### Parts
C32  0.1 uF  [C0805C]
C37  18 pF  [C0805C]
C38  18 pF  [C0805C]
C39  10nFx1kV  [C0805C]
DD9  PRTR5V0U2X  [SOT143B]
R43  10  [C0805R]
R44  10  [C0805R]
XS13  Text  [SAMTEC_USB-B-S-X-X-TH]

### Ports
USB_DM (bidir), USB_DP (bidir)

### Nets
GND: C32.1 C37.1 C38.1 C39.1 DD9.1(GND) XS13.4
USB_D_N: C37.2 DD9.3(I/O_2) R43.2 XS13.2
USB_D_P: C38.2 DD9.2(I/O_1) R44.2 XS13.3
NetC32_2: C32.2 DD9.4(VCC) XS13.1
NetC39_2: C39.2 XS13.S1 XS13.S2
NetDD5_32: R43.1 ; port USB_DM
NetDD5_33: R44.1 ; port USB_DP

### Layout directives
differential pair: USB_D_N, USB_D_P

### Notes on the sheet
- (in symbol CONNECT_USB) +5В; D-; D+; Общ; Экр

### Library data of the parts
C32 C37 C38 = CAP_0805: Type: Конденсатор; Published: 18.05.2010; Publisher: Andrew Danich
C39 = CAP_1206: Type: Конденсатор; Published: 18.05.2010; Publisher: Andrew Danich
DD9 = PRTR5V0U2X,215: Ultra low capacitance double rail-to-rail ESD protection diode; Package: None; MP: PRTR5V0U2X,215; Price: None; Availability: Unavailable; Value: *
R43 R44 = RES_0805: Published: 24.03.2010; Publisher: Andrew Danich; Type: Резистор
XS13 = CONNECT_USB: Published: 11.04.2016; Publisher: Andrew Danich; Type: Розетка

## Sheet RS485.SchDoc
size A3
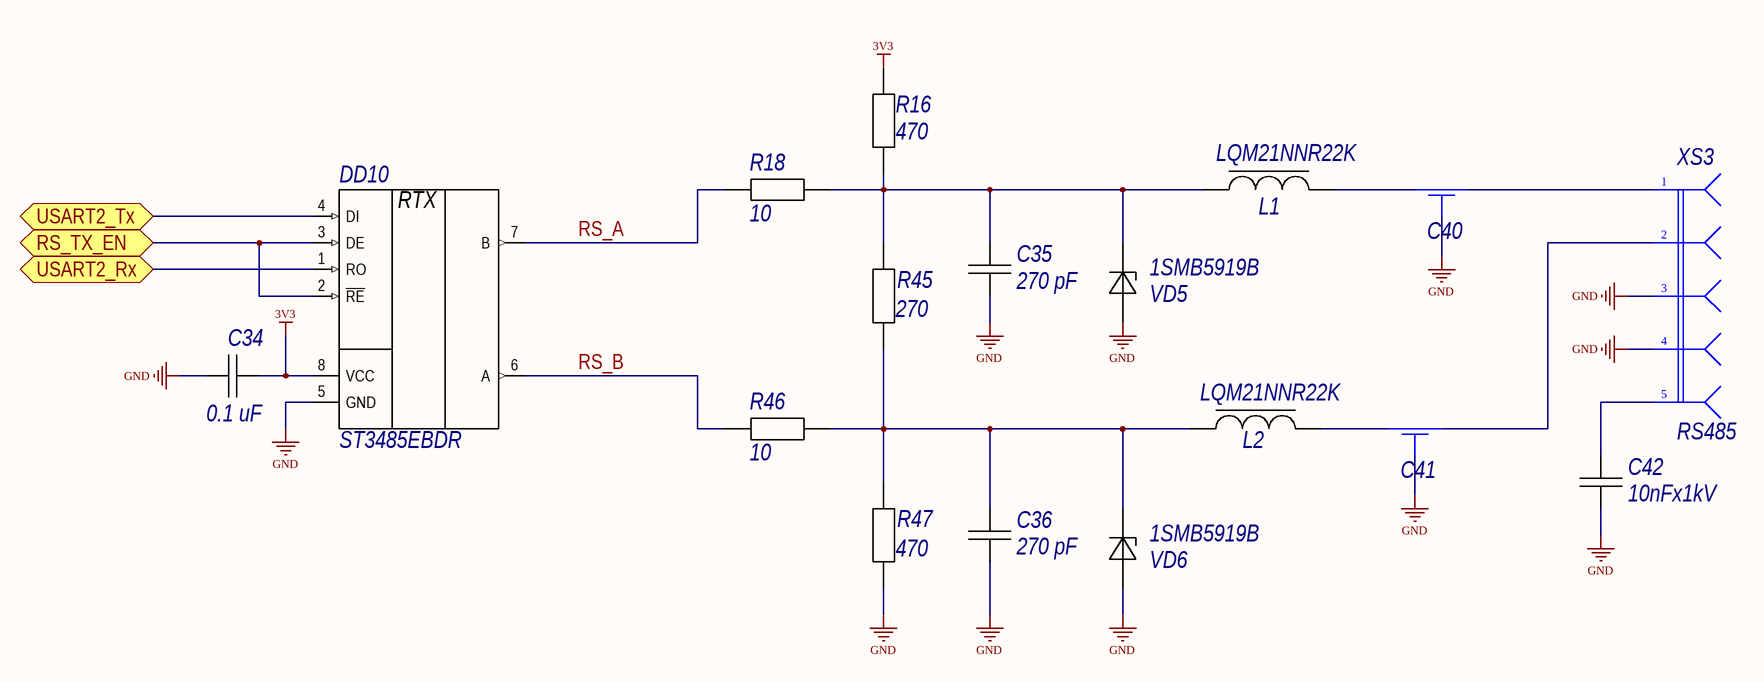
[diagram p11: RS485.SchDoc]

### Parts
C34  0.1 uF  [C0805C]
C35  270 pF  [C0805C]
C36  270 pF  [C0805C]
C40  NFM3DCC222R1H3L  [NFM3DCC222R1H3L]  (value not drawn)
C41  NFM3DCC222R1H3L  [NFM3DCC222R1H3L]  (value not drawn)
C42  10nFx1kV  [C0805C]
DD10  ST3485EBDR  [SOIC8 (SO-8)]
L1  LQM21NNR22K  [L0805]
L2  LQM21NNR22K  [L0805]
R16  470  [C0805R]
R18  10  [C0805R]
R45  270  [C0805R]
R46  10  [C0805R]
R47  470  [C0805R]
VD5  1SMB5919B  [DO214AA SMB]
VD6  1SMB5919B  [DO214AA SMB]
XS3  RS485  [WF-5]

### Ports
RS_TX_EN (bidir), USART2_Rx (bidir), USART2_Tx (bidir)

### Nets
3V3: C34.2 DD10.8(VCC) R16.1
GND: C34.1 C35.1 C36.1 C40.2 C41.2 C42.1 DD10.5(GND) R47.1 VD5.1(А) VD6.1(А) XS3.3 XS3.4
RS_A: DD10.7(B) R18.2
RS_B: DD10.6(A) R46.2
RS_EN: DD10.2(~{RE}) DD10.3(DE) ; port RS_TX_EN
RS_RX: DD10.1(RO) ; port USART2_Rx
RS_TX: DD10.4(DI) ; port USART2_Tx
NetC35_2: C35.2 L1.1 R16.2 R18.1 R45.2 VD5.2(К)
NetC36_2: C36.2 L2.1 R45.1 R46.1 R47.2 VD6.2(К)
NetC40_1: C40.1 L1.2
NetC40_3: C40.3 XS3.1
NetC41_1: C41.1 L2.2
NetC41_3: C41.3 XS3.2
NetC42_2: C42.2 XS3.5

### Notes on the sheet
- (in symbol ST3485EBDR) RTX

### Library data of the parts
C34-C36 = CAP_0805: Type: Конденсатор; Published: 18.05.2010; Publisher: Andrew Danich
C40 C41 = NFM3DCC222R1H3L: Type: Конденсатор; Published: 06.07.2014; Publisher: Andrew Danich
C42 = CAP_1206: Type: Конденсатор; Published: 18.05.2010; Publisher: Andrew Danich
L1 L2 = LQM21NNR22K: Type: Дроссель; Published: 20.05.2010; Publisher: Andrew Danich
R16 R18 R45-R47 = RES_0805: Published: 24.03.2010; Publisher: Andrew Danich; Type: Резистор
VD5 VD6 = 1SMB5919B: Type: Стабилитрон; Published: 20.05.2013; Publisher: Andrew Danich
XS3 = CONNECT_SEQ: Value: Connector; Published: 07.03.2013; Publisher: Andrew Danich; Type: Розетка
DD10 = ST3485EBDR: Published: 26.02.2013; Publisher: Andrew Danich; Type: Микросхема

## Nets that join several sheets
3V3: POWER_SUPPLY (5 pins), CAN (C13.2 DD3.3), FLASH (5 pins), DS18B20 (R4.1 XS4.1 XS5.1 XS6.1), DIRECTIONAL_COUPLER (VD2.3), JTAG_MCU (6 pins), MCU_CORE (13 pins), IIC_LCD (DD7.2 R34.2 R35.2), EEPROM (7 pins), RS485 (C34.2 DD10.8 R16.1)
5V: POWER_SUPPLY (5 pins), IIC_LCD (12 pins)
+8V: POWER_SUPPLY (C12.2 DA1.3), DIRECTIONAL_COUPLER (C15.2 DA2.4)
+12V: POWER_SUPPLY (9 pins), FAN_CTRL (R15.2 XS8.2)
GND: POWER_SUPPLY (16 pins), CAN (C13.1 DD3.2 R1.2 XS2.3), FLASH (C14.1 DD4.4), DS18B20 (XS4.3 XS5.3 XS6.3), DIRECTIONAL_COUPLER (11 pins), FAN_CTRL (VD4.1 XS8.1), JTAG_MCU (10 pins), MCU_CORE (18 pins), IIC_LCD (11 pins), EEPROM (C31.1 DD8.4 DD8.7), USB (6 pins), RS485 (12 pins)
CAN1_RXD: CAN (DD3.4), MCU_CORE (DD5.45)
CAN1_TXD: CAN (DD3.1), MCU_CORE (DD5.46)
DS18B20: DS18B20 (R4.2 XS4.2 XS5.2 XS6.2), MCU_CORE (DD5.30)
FLASH_CLK: FLASH (DD4.6), MCU_CORE (DD5.15)
FLASH_CS: FLASH (DD4.1 R3.1), MCU_CORE (DD5.14)
FLASH_MISO: FLASH (DD4.2), MCU_CORE (DD5.16)
FLASH_MOSI: FLASH (DD4.5), MCU_CORE (DD5.17)
I2C3_SCL: MCU_CORE (DD5.21), EEPROM (DD8.6 R39.1)
I2C3_SDA: MCU_CORE (DD5.22), EEPROM (DD8.5 R38.1)
JNTRST: JTAG_MCU (R19.1 XS10.3), MCU_CORE (DD5.40)
JTCK: JTAG_MCU (R23.2 XS10.9), MCU_CORE (DD5.37)
JTDI: JTAG_MCU (R20.1 XS10.5), MCU_CORE (DD5.38)
JTDO: JTAG_MCU (R22.1 XS10.13), MCU_CORE (DD5.39)
JTMS: JTAG_MCU (R21.1 XS10.7), MCU_CORE (DD5.34)
LCD_SCL: MCU_CORE (DD5.42), IIC_LCD (DD7.3 R34.1)
LCD_SDA: MCU_CORE (DD5.43), IIC_LCD (DD7.4 R35.1)
NetDD5_32: MCU_CORE (DD5.32), USB (R43.1)
NetDD5_33: MCU_CORE (DD5.33), USB (R44.1)
NRST: JTAG_MCU (XS10.15), MCU_CORE (C24.2 DD5.7 R25.2 SB1.1)
PWM_1: FAN_CTRL (R17.1), MCU_CORE (DD5.10)
RS_EN: MCU_CORE (DD5.11), RS485 (DD10.2 DD10.3)
RS_RX: MCU_CORE (DD5.13), RS485 (DD10.1)
RS_TX: MCU_CORE (DD5.12), RS485 (DD10.4)
SWR_F: DIRECTIONAL_COUPLER (R11.1 VD2.2), MCU_CORE (DD5.19)
SWR_R: DIRECTIONAL_COUPLER (R6.1 VD2.1), MCU_CORE (DD5.18)
T_1: FAN_CTRL (R15.1 XS8.3), MCU_CORE (DD5.25)